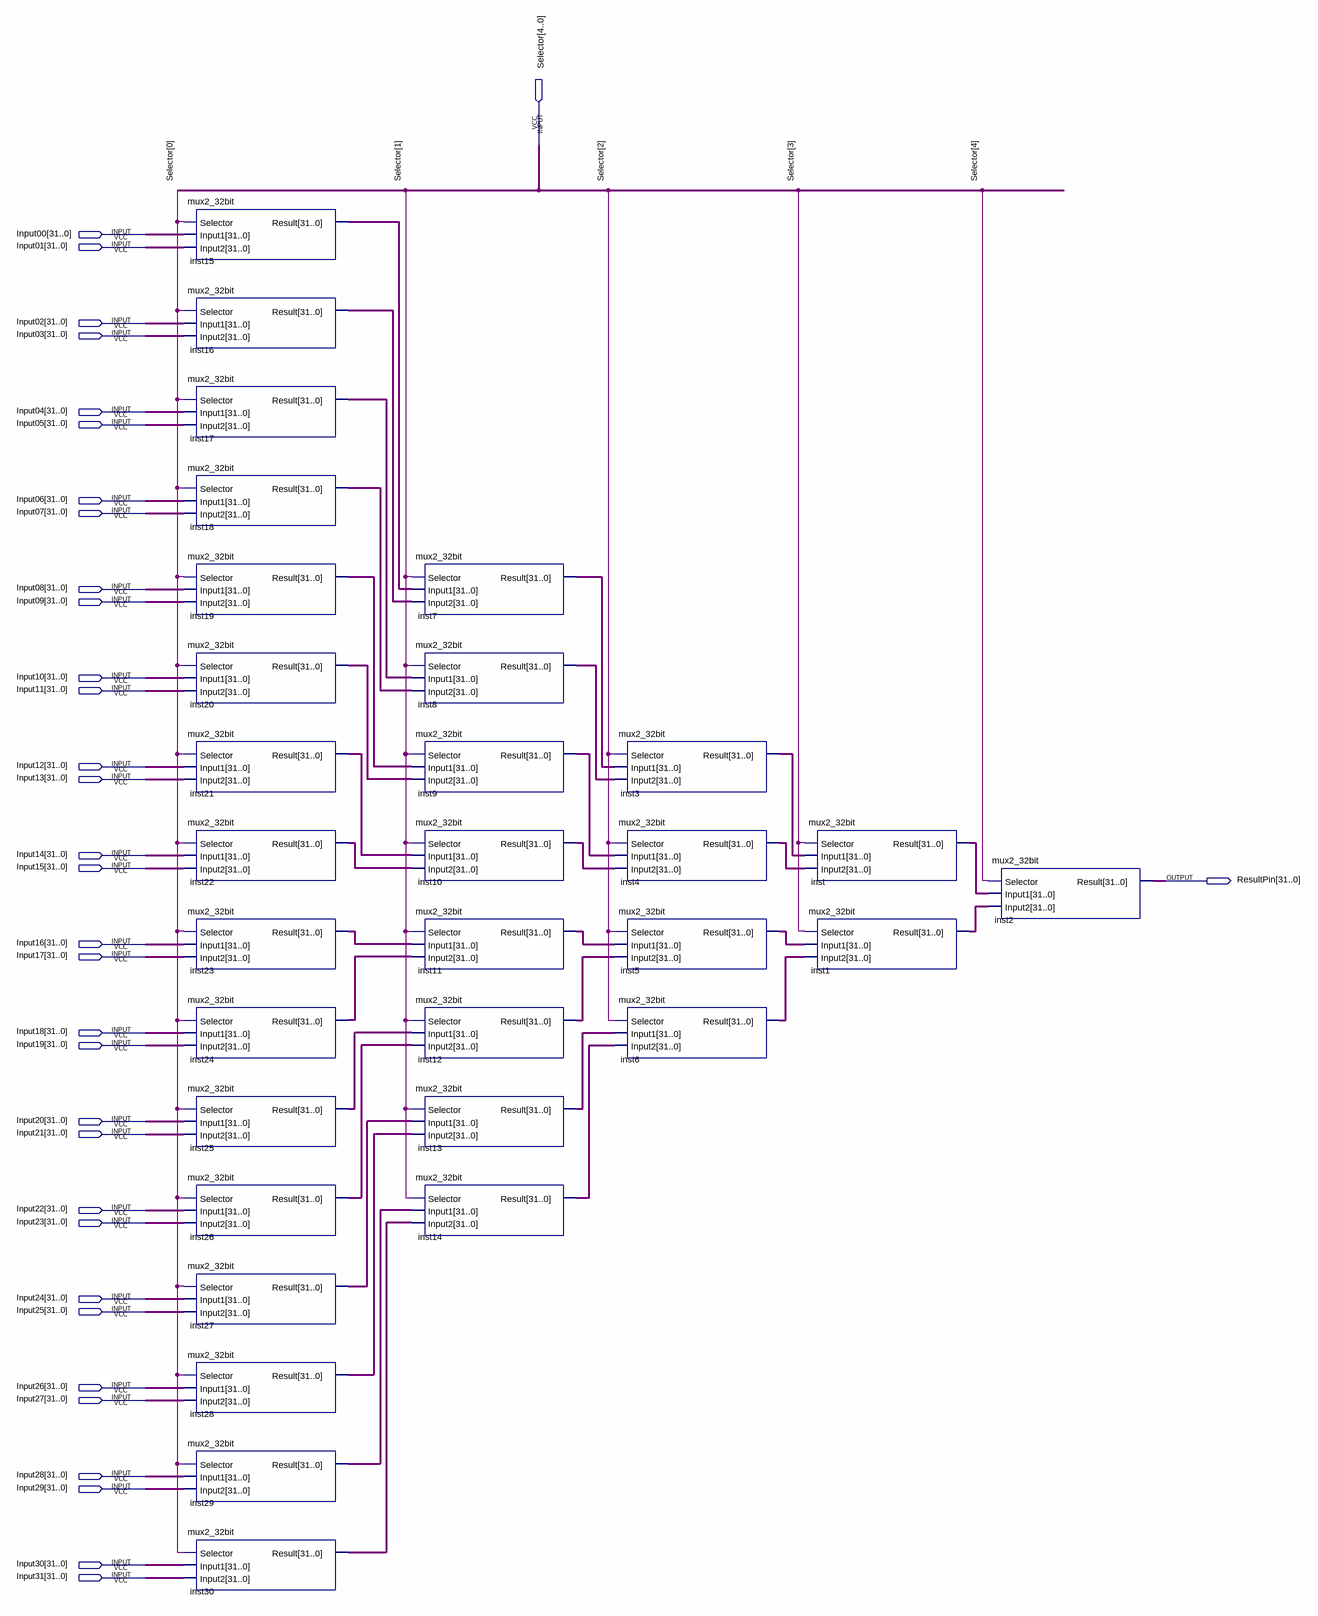
[diagram p0: schematic sheet]
// Quartus schematic mux32_32bit.bdf as structural Verilog: 31 symbols, 34 pins
module mux32_32bit (
  input  [4:0] Selector,
  input  [31:0] Input00,
  input  [31:0] Input01,
  input  [31:0] Input02,
  input  [31:0] Input03,
  input  [31:0] Input04,
  input  [31:0] Input05,
  input  [31:0] Input06,
  input  [31:0] Input07,
  input  [31:0] Input08,
  input  [31:0] Input09,
  input  [31:0] Input10,
  input  [31:0] Input11,
  input  [31:0] Input12,
  input  [31:0] Input13,
  input  [31:0] Input14,
  input  [31:0] Input15,
  input  [31:0] Input16,
  input  [31:0] Input17,
  input  [31:0] Input18,
  input  [31:0] Input19,
  input  [31:0] Input20,
  input  [31:0] Input21,
  input  [31:0] Input22,
  input  [31:0] Input23,
  input  [31:0] Input24,
  input  [31:0] Input25,
  input  [31:0] Input26,
  input  [31:0] Input27,
  input  [31:0] Input28,
  input  [31:0] Input29,
  input  [31:0] Input30,
  input  [31:0] Input31,
  output [31:0] ResultPin
);

  wire [31:0] inst1_result, inst3_result, inst4_result, inst5_result, inst6_result, inst7_result,
       inst8_result, inst9_result, inst10_result, inst11_result, inst12_result, inst13_result, inst14_result,
       inst15_result, inst16_result, inst17_result, inst18_result, inst19_result, inst20_result,
       inst21_result, inst22_result, inst23_result, inst24_result, inst25_result, inst26_result,
       inst27_result, inst28_result, inst29_result, inst30_result, inst_result;

  mux2_32bit inst15 (.Selector(Selector[0]), .Input1(Input00), .Input2(Input01), .Result(inst15_result));
  mux2_32bit inst16 (.Selector(Selector[0]), .Input1(Input02), .Input2(Input03), .Result(inst16_result));
  mux2_32bit inst17 (.Selector(Selector[0]), .Input1(Input04), .Input2(Input05), .Result(inst17_result));
  mux2_32bit inst18 (.Selector(Selector[0]), .Input1(Input06), .Input2(Input07), .Result(inst18_result));
  mux2_32bit inst19 (.Selector(Selector[0]), .Input1(Input08), .Input2(Input09), .Result(inst19_result));
  mux2_32bit inst20 (.Selector(Selector[0]), .Input1(Input10), .Input2(Input11), .Result(inst20_result));
  mux2_32bit inst21 (.Selector(Selector[0]), .Input1(Input12), .Input2(Input13), .Result(inst21_result));
  mux2_32bit inst22 (.Selector(Selector[0]), .Input1(Input14), .Input2(Input15), .Result(inst22_result));
  mux2_32bit inst23 (.Selector(Selector[0]), .Input1(Input16), .Input2(Input17), .Result(inst23_result));
  mux2_32bit inst24 (.Selector(Selector[0]), .Input1(Input18), .Input2(Input19), .Result(inst24_result));
  mux2_32bit inst25 (.Selector(Selector[0]), .Input1(Input20), .Input2(Input21), .Result(inst25_result));
  mux2_32bit inst26 (.Selector(Selector[0]), .Input1(Input22), .Input2(Input23), .Result(inst26_result));
  mux2_32bit inst27 (.Selector(Selector[0]), .Input1(Input24), .Input2(Input25), .Result(inst27_result));
  mux2_32bit inst28 (.Selector(Selector[0]), .Input1(Input26), .Input2(Input27), .Result(inst28_result));
  mux2_32bit inst29 (.Selector(Selector[0]), .Input1(Input28), .Input2(Input29), .Result(inst29_result));
  mux2_32bit inst30 (.Selector(Selector[0]), .Input1(Input30), .Input2(Input31), .Result(inst30_result));
  mux2_32bit inst7 (.Selector(Selector[1]), .Input1(inst15_result), .Input2(inst16_result), .Result(inst7_result));
  mux2_32bit inst8 (.Selector(Selector[1]), .Input1(inst17_result), .Input2(inst18_result), .Result(inst8_result));
  mux2_32bit inst9 (.Selector(Selector[1]), .Input1(inst19_result), .Input2(inst20_result), .Result(inst9_result));
  mux2_32bit inst10 (.Selector(Selector[1]), .Input1(inst21_result), .Input2(inst22_result), .Result(inst10_result));
  mux2_32bit inst11 (.Selector(Selector[1]), .Input1(inst23_result), .Input2(inst24_result), .Result(inst11_result));
  mux2_32bit inst12 (.Selector(Selector[1]), .Input1(inst25_result), .Input2(inst26_result), .Result(inst12_result));
  mux2_32bit inst13 (.Selector(Selector[1]), .Input1(inst27_result), .Input2(inst28_result), .Result(inst13_result));
  mux2_32bit inst14 (.Selector(Selector[1]), .Input1(inst29_result), .Input2(inst30_result), .Result(inst14_result));
  mux2_32bit inst3 (.Selector(Selector[2]), .Input1(inst7_result), .Input2(inst8_result), .Result(inst3_result));
  mux2_32bit inst4 (.Selector(Selector[2]), .Input1(inst9_result), .Input2(inst10_result), .Result(inst4_result));
  mux2_32bit inst5 (.Selector(Selector[2]), .Input1(inst11_result), .Input2(inst12_result), .Result(inst5_result));
  mux2_32bit inst6 (.Selector(Selector[2]), .Input1(inst13_result), .Input2(inst14_result), .Result(inst6_result));
  mux2_32bit inst (.Selector(Selector[3]), .Input1(inst3_result), .Input2(inst4_result), .Result(inst_result));
  mux2_32bit inst1 (.Selector(Selector[3]), .Input1(inst5_result), .Input2(inst6_result), .Result(inst1_result));
  mux2_32bit inst2 (.Selector(Selector[4]), .Input1(inst_result), .Input2(inst1_result), .Result(ResultPin));
endmodule
